# Altium project LAUNCHXL-F28377S.PrjPcb
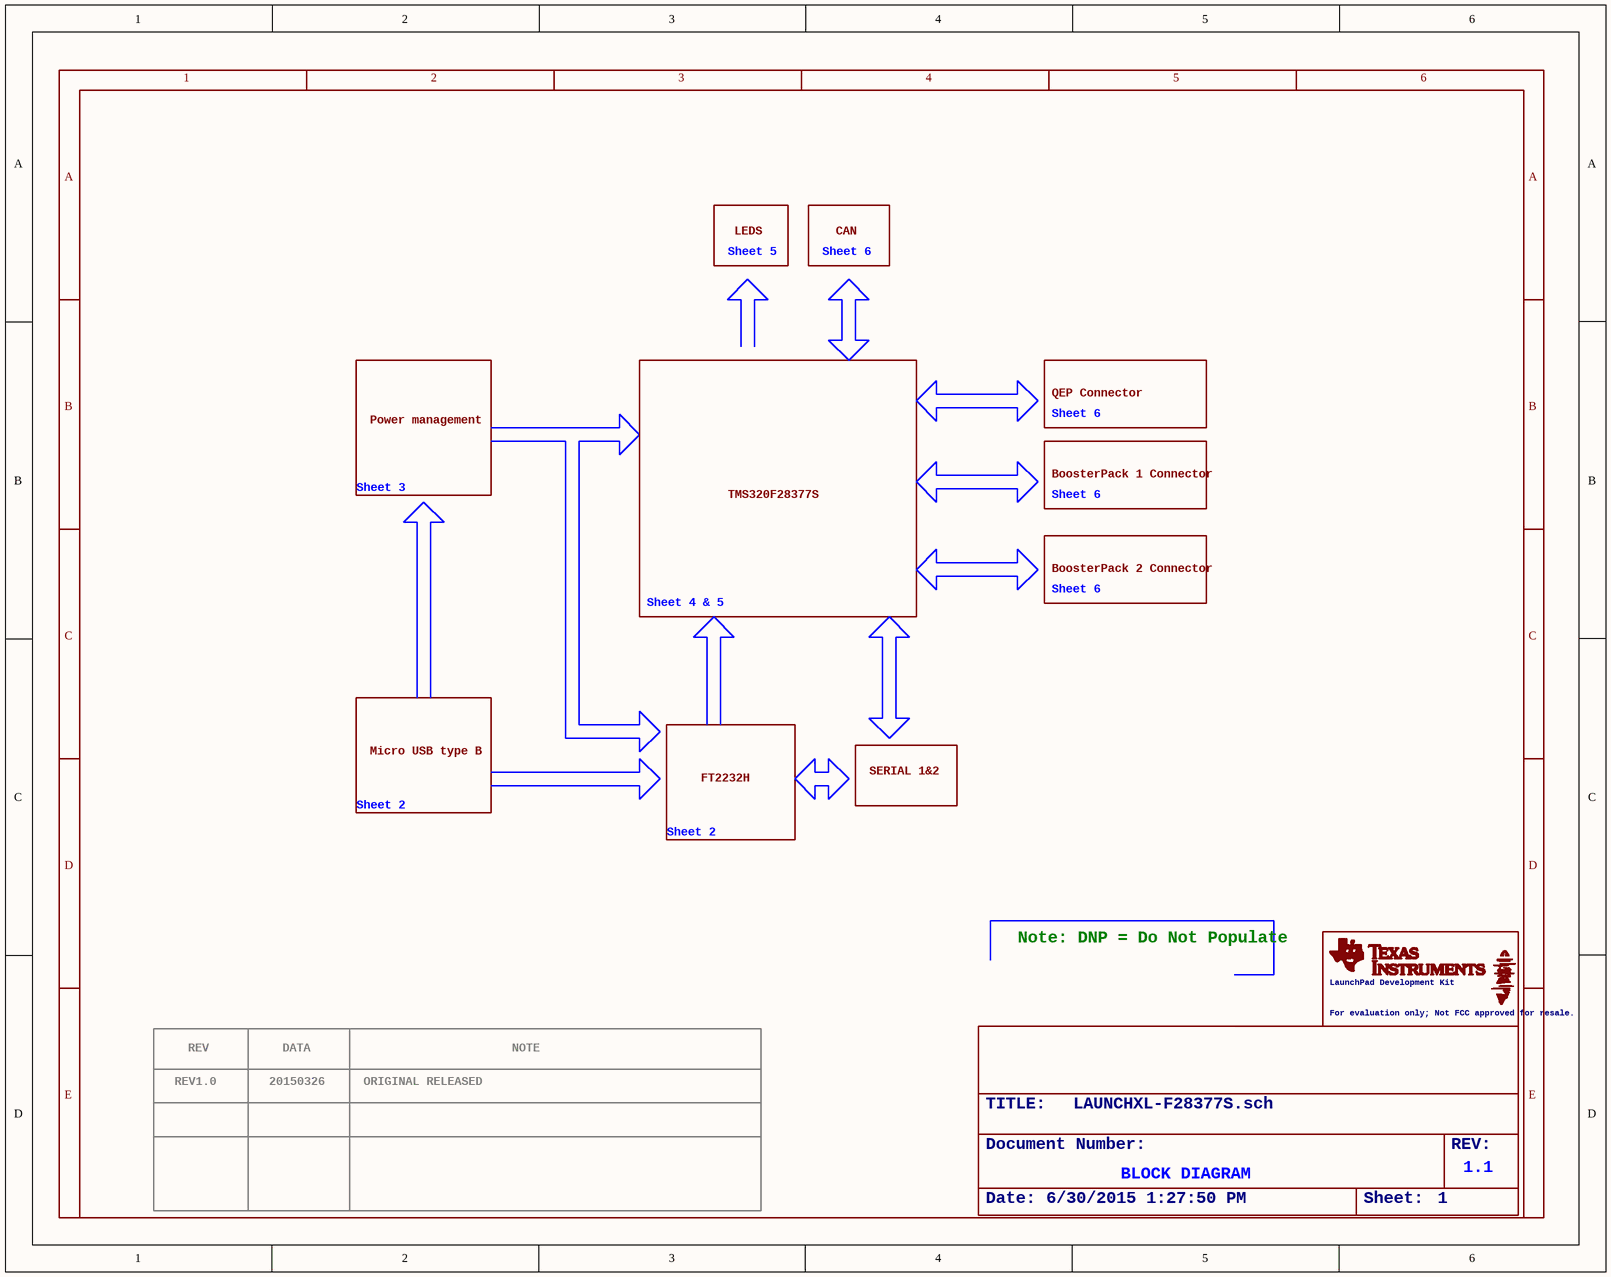
[diagram p0: LAUNCHXL-F28377S_0.SchDoc]
6 sheets, 203 parts. Net scope: global (net labels, ports and power ports of the same name join across sheets).
Sheets:
  LAUNCHXL-F28377S_0.SchDoc
  LAUNCHXL-F28377S_1.SchDoc
  LAUNCHXL-F28377S_2.SchDoc
  LAUNCHXL-F28377S_3.SchDoc
  LAUNCHXL-F28377S_4.SchDoc
  LAUNCHXL-F28377S_5.SchDoc

## Sheet LAUNCHXL-F28377S_0.SchDoc: LAUNCHXL-F28377S.sch
size 301 x 238 mm; Date: 6/30/2015 1:27:50 PM; DocumentNumber: Document Number:; Revision: REV:; SheetNumber: 1

### Parts
COMPLIANCE1  COMPLIANCE_NOT_FCC_TESTEDBOARDS_LARGER_THAN_4IN  [COMPLIANCE_NOT_FCC]  (value not drawn)

### Notes on the sheet
- Sheet 5
- LEDS
- Sheet 6
- CAN
- QEP Connector
- Sheet 3
- Power management
- BoosterPack 1 Connector
- TMS320F28377S
- Sheet 4 & 5
- BoosterPack 2 Connector
- Micro USB type B
- Sheet 2
- FT2232H
- SERIAL 1&2
- Note: DNP = Do Not Populate
- REV1.0
- REV
- 20150326
- DATA
- ORIGINAL RELEASED
- NOTE
- BLOCK DIAGRAM
- 1.1
- 1
- 2
- 3
- 4
- 5
- 6
- A
- B
- C
- D
- E

### Library data of the parts
COMPLIANCE1 = COMPLIANCE_NOT_FCC_TESTEDBOARDS_LARGER_THAN_4IN: For evaluation only;

## Sheet LAUNCHXL-F28377S_1.SchDoc: LAUNCHXL-F28377S.sch
size 301 x 237 mm; Date: 6/30/2015 1:27:53 PM; DocumentNumber: Document Number:; Revision: REV:; SheetNumber: 2
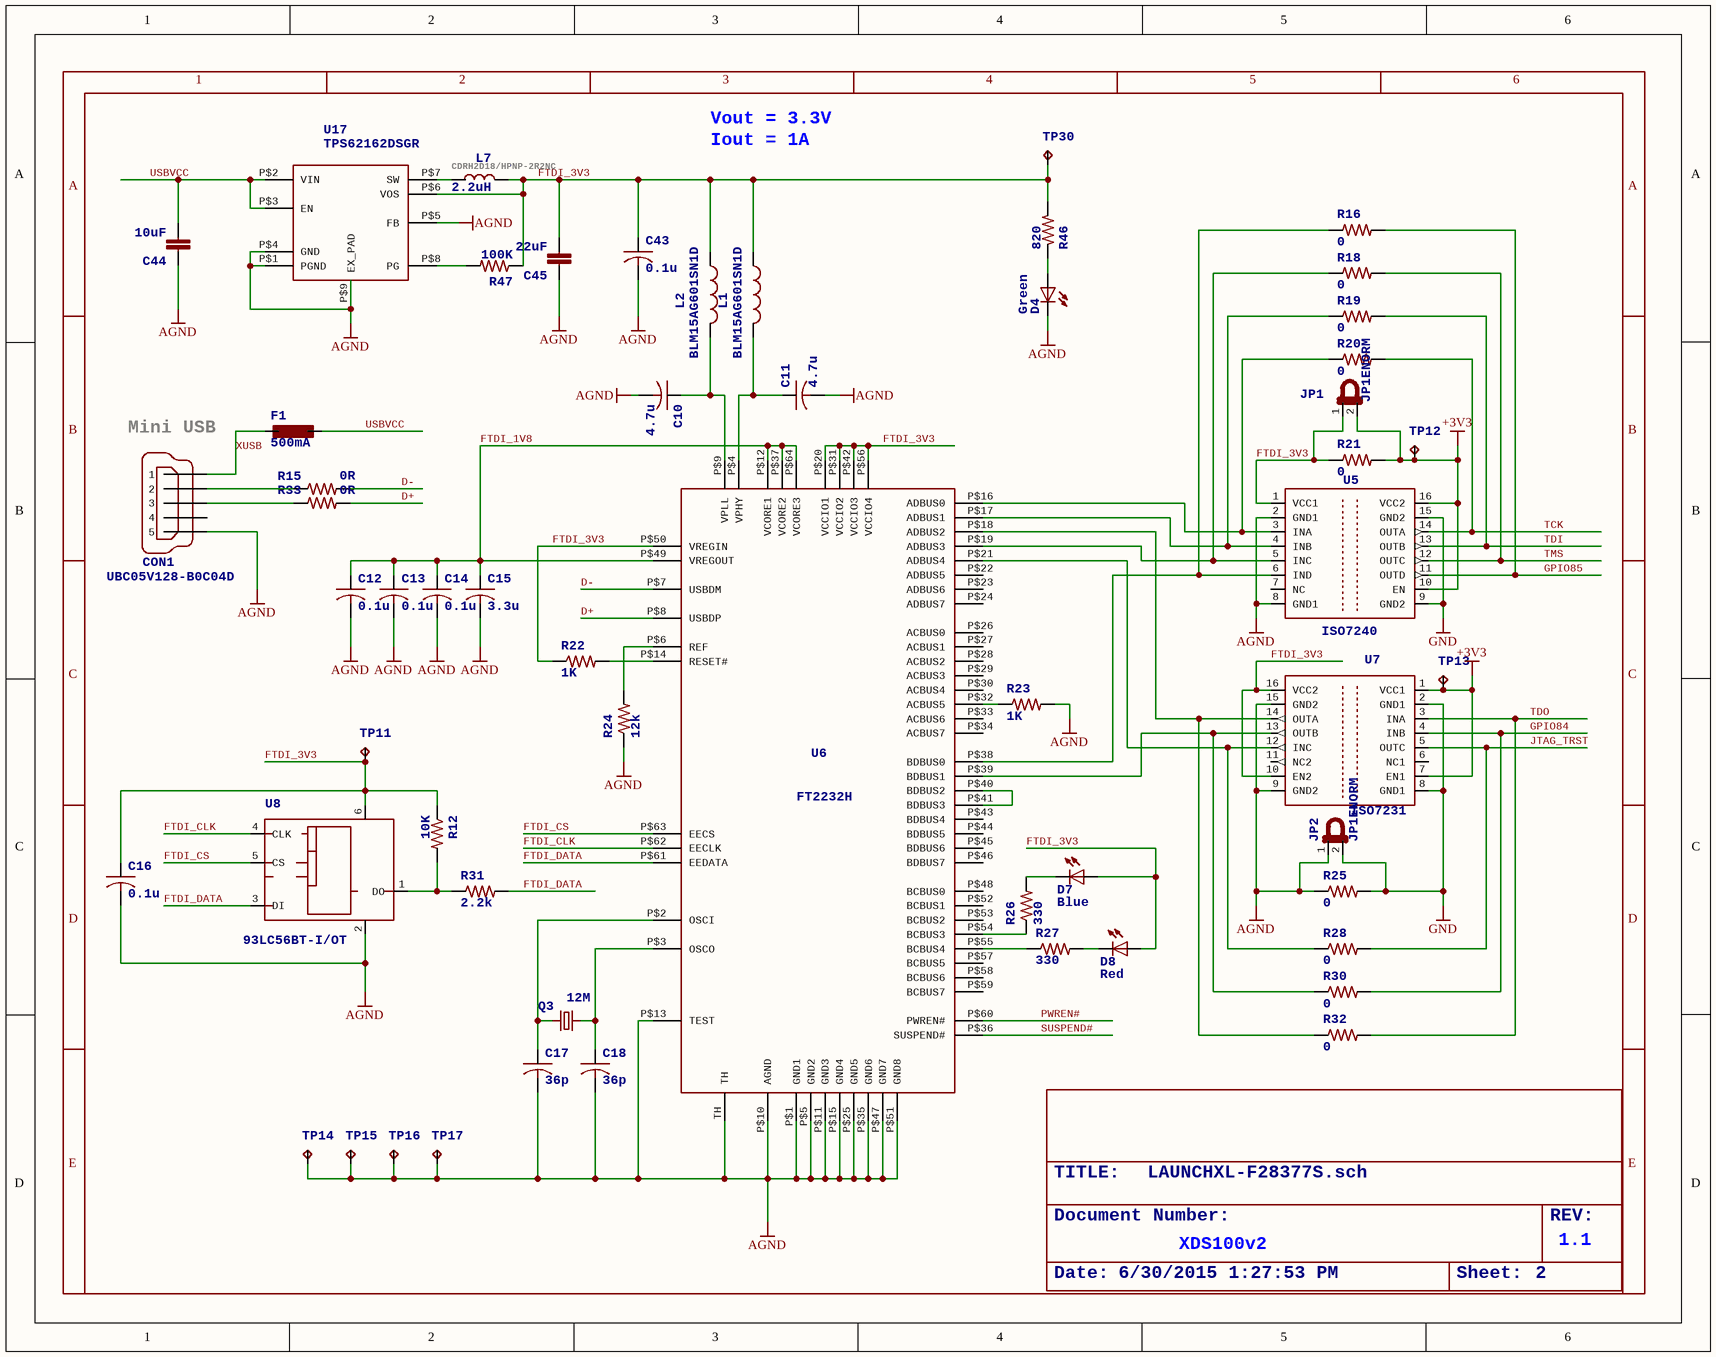
[diagram p1: LAUNCHXL-F28377S_1.SchDoc]

### Parts
C10  4.7u  [C0402]
C11  4.7u  [C0402]
C12  0.1u  [C0402]
C13  0.1u  [C0402]
C14  0.1u  [C0402]
C15  3.3u  [C0402]
C16  0.1u  [C0402]
C17  36p  [C0402]
C18  36p  [C0402]
C43  0.1u  [C0402]
C44  10uF  [SPARKFUN_1210]
C45  22uF  [SPARKFUN_1210]
CON1  UBC05V128-B0C04D  [32005-201]
D4  Green  [CHIP-LED0603]
D7  Blue  [CHIP-LED0603]
D8  Red  [CHIP-LED0603]
F1  500mA  [L1812]
JP1  JP1ENORM  [JP1]
JP2  JP1ENORM  [JP1]
L1  BLM15AG601SN1D  [R0402]
L2  BLM15AG601SN1D  [R0402]
L7  2.2uH  [INDUCT-3.2*3.2]
Q3  12M  [HC49UP]
R12  10K  [R0402]
R15  0R  [R0402]
R16  0  [R1206]
R18  0  [R1206]
R19  0  [R1206]
R20  0  [R1206]
R21  0  [R1206]
R22  1K  [R0402]
R23  1K  [R0402]
R24  12k  [R0402]
R25  0  [R1206]
R26  330  [R0402]
R27  330  [R0402]
R28  0  [R1206]
R30  0  [R1206]
R31  2.2k  [R0402]
R32  0  [R1206]
R33  0R  [R0402]
R46  820  [R0402]
R47  100K  [R0402]
TP11  TESTPAD_TPB1,27  [TESTPAD_B1,27]  (value not drawn)
TP12  TESTPAD_TPB1,27  [TESTPAD_B1,27]  (value not drawn)
TP13  TESTPAD_TPB1,27  [TESTPAD_B1,27]  (value not drawn)
TP14  TESTPAD_TPB1,27  [TESTPAD_B1,27]  (value not drawn)
TP15  TESTPAD_TPB1,27  [TESTPAD_B1,27]  (value not drawn)
TP16  TESTPAD_TPB1,27  [TESTPAD_B1,27]  (value not drawn)
TP17  TESTPAD_TPB1,27  [TESTPAD_B1,27]  (value not drawn)
TP30  TESTPAD_TPB1,27  [TESTPAD_B1,27]  (value not drawn)
U5  ISO7240  [SO-16DW]
U6  FT2232H  [QFN64]
U7  ISO7231  [SO-16DW]
U8  93LC56BT-I/OT  [SOT23-6]
U17  TPS62162DSGR  [TI_DSG8]
U$10  ROY_JUMPER  [ROY_JUMPER]  (value not drawn)
U$11  ROY_JUMPER  [ROY_JUMPER]  (value not drawn)

### Nets
+3V3: JP1.2 R21.2 TP12.TP TP13.TP U5.10(EN) U5.16(VCC2) U7.1(VCC1) U7.7(EN1)
AGND: C10.2 C11.2 C12.2 C13.2 C14.2 C15.2 C16.2 C17.2 C18.2 C43.2 C44.1 C45.1 CON1.5 D4.C JP2.1 R23.2 R24.1 R25.1 TP14.TP TP15.TP TP16.TP TP17.TP U5.2(GND1) U5.8(GND1) U6.P$1(GND1) U6.P$5(GND2) U6.P$10(AGND) U6.P$11(GND3) U6.P$13(TEST) U6.P$15(GND4) U6.P$25(GND5) U6.P$35(GND6) U6.P$47(GND7) U6.P$51(GND8) U6.TH U7.9(GND2) U7.15(GND2) U8.2(GND) U17.P$1(PGND) U17.P$4(GND) U17.P$5(FB) U17.P$9(EX_PAD)
GND: JP2.2 R25.2 U5.9(GND2) U5.15(GND2) U7.2(GND1) U7.8(GND1)
D+: R33.2 U6.P$8(USBDP)
D-: R15.2 U6.P$7(USBDM)
FTDI_1V8: C12.1 C13.1 C14.1 C15.1 U6.P$12(VCORE1) U6.P$37(VCORE2) U6.P$49(VREGOUT) U6.P$64(VCORE3)
FTDI_3V3: C16.1 C43.1 C45.2 D7.A D8.A JP1.1 L1.1 L2.1 L7.P$1 R12.1 R21.1 R22.1 R46.2 R47.1 TP11.TP TP30.TP U5.1(VCC1) U6.P$20(VCCIO1) U6.P$31(VCCIO2) U6.P$42(VCCIO3) U6.P$50(VREGIN) U6.P$56(VCCIO4) U7.10(EN2) U7.16(VCC2) U8.6(VCC) U17.P$6(VOS)
FTDI_CLK: U6.P$62(EECLK) U8.4(CLK)
FTDI_CS: U6.P$63(EECS) U8.5(CS)
FTDI_DATA: R31.2 U6.P$61(EEDATA) U8.3(DI)
GPIO84: R30.2 U7.4(INB)
GPIO85: R16.2 U5.11(OUTD)
JTAG_TRST: R28.2 U7.5(OUTC)
PWREN#: U6.P$60(PWREN#)
SUSPEND#: U6.P$36(SUSPEND#)
TCK: R20.2 U5.14(OUTA)
TDI: R19.2 U5.13(OUTB)
TDO: R32.2 U7.3(INA)
TMS: R18.2 U5.12(OUTC)
USBVCC: C44.2 F1.1 U17.P$2(VIN) U17.P$3(EN)
XUSB: CON1.1 F1.2
NetC10_1: C10.1 L2.2 U6.P$9(VPLL)
NetC11_1: C11.1 L1.2 U6.P$4(VPHY)
NetC17_1: C17.1 Q3.1 U6.P$2(OSCI)
NetC18_1: C18.1 Q3.2 U6.P$3(OSCO)
NetCON1_2: CON1.2 R15.1
NetCON1_3: CON1.3 R33.1
NetD4_A: D4.A R46.1
NetD7_C: D7.C R26.2
NetD8_C: D8.C R27.2
NetL7_P$2: L7.P$2 U17.P$7(SW)
NetR12_2: R12.2 R31.1 U8.1(DO)
NetR16_1: R16.1 U5.6(IND) U6.P$38(BDBUS0)
NetR18_1: R18.1 U5.5(INC) U6.P$19(ADBUS3)
NetR19_1: R19.1 U5.4(INB) U6.P$17(ADBUS1)
NetR20_1: R20.1 U5.3(INA) U6.P$16(ADBUS0)
NetR22_2: R22.2 U6.P$14(RESET#)
NetR23_1: R23.1 U6.P$32(ACBUS5)
NetR24_2: R24.2 U6.P$6(REF)
NetR26_1: R26.1 U6.P$54(BCBUS3)
NetR27_1: R27.1 U6.P$55(BCBUS4)
NetR28_1: R28.1 U6.P$21(ADBUS4) U7.12(INC)
NetR30_1: R30.1 U6.P$39(BDBUS1) U7.13(OUTB)
NetR32_1: R32.1 U6.P$18(ADBUS2) U7.14(OUTA)
NetR47_2: R47.2 U17.P$8(PG)
NetU6_P$40: U6.P$40(BDBUS2) U6.P$41(BDBUS3)

Not connected (* = marked no-connect by the designer): CON1 4; U5 7(NC); U6 P$22(ADBUS5) P$23(ADBUS6) P$24(ADBUS7) P$26(ACBUS0) P$27(ACBUS1) P$28(ACBUS2) P$29(ACBUS3) P$30(ACBUS4) P$33(ACBUS6) P$34(ACBUS7) P$43(BDBUS4) P$44(BDBUS5) P$45(BDBUS6) P$46(BDBUS7) P$48(BCBUS0) P$52(BCBUS1) P$53(BCBUS2) P$57(BCBUS5) P$58(BCBUS6) P$59(BCBUS7); U7 6(NC1) 11(NC2)

### Notes on the sheet
- Vout = 3.3V
- Iout = 1A
- (near L7) CDRH2D18/HPNP-2R2NC
- (near CON1) Mini USB
- XDS100v2
- 1.1
- 1
- 2
- 3
- 4
- 5
- 6
- A
- B
- C
- D
- E

### Library data of the parts
C10-C18 C43 = C-USC0402: <B>CAPACITOR</B>, American symbol
C44 C45 = SPARKFUN_CAP1210: <b>Capacitor</b> / Standard 0603 ceramic capacitor, and 0.1" leaded capacitor.
CON1 = MINI-USB-32005-201: <b>MINI USB-B Conector</b><p> / Source: www.cypressindustries.com
D4 D7 D8 = LEDCHIP-LED0603: <b>LED</b><p> / <u>OSRAM</u>:<br> / - <u>CHIPLED</u><br> / LG R971, LG N971, LY N971, LG Q971, LY Q971, LO R971, LY R971 / LH N974, LH R974<br> / LS Q976, LO Q976, LY Q976<br> / LO Q996<br> / - <u>Hyper CHIPLED</u><br> / LW Q18S<br> / LB Q993, LB Q99A, LB R99A<br> / - <u>SideLED</u><br> / LS A670, LO A670, LY A670, LG A670, LP A670<br> / LB A673, LV A673, LT A673, LW A673<br> / LH A674<br> / LY A675<br> / LS A676, LA A676, LO A676, LY A676, LW A676<br> / LS A679, LY A679, LG A679<br> / -  <u>Hyper Micro SIDELED®</u><br> / LS Y876, LA Y876, LO Y876, LY Y876<br> / LT Y87S<br> / - <u>SmartLED</u><br> / LW L88C, LW L88S<br> / LB L89C, LB L89S, LG L890<br> / LS L89K, LO L89K, LY L89K<br> / LS L896, LA L896, LO L896, LY L896<br> / - <u>TOPLED</u><br> / LS T670, LO T670, LY T670, LG T670, LP T670<br> / LSG T670, LSP T670, LSY T670, LOP T670, LYG T670<br> / LG T671, LOG T671, LSG T671<br> / LB T673, LV T673, LT T673, LW T673<br> / LH T674<br> / LS T676, LA T676, LO T676, LY T676, LB T676, LH T676, LSB T676, LW T676<br> / LB T67C, LV T67C, LT T67C, LS T67K, LO T67K, LY T67K, LW E67C<br> / LS E67B, LA E67B, LO E67B, LY E67B, LB E67C, LV E67C, LT E67C<br> / LW T67C<br> / LS T679, LY T679, LG T679<br> / LS T770, LO T770, LY T770, LG T770, LP T770<br> / LB T773, LV T773, LT T773, LW T773<br> / LH T774<br> / LS E675, LA E675, LY E675, LS T675<br> / LS T776, LA T776, LO T776, LY T776, LB T776<br> / LHGB T686<br> / LT T68C, LB T68C<br> / - <u>Hyper Mini TOPLED®</u><br> / LB M676<br> / - <u>Mini TOPLED Santana®</u><br> / LG M470<br> / LS M47K, LO M47K, LY M47K / <p> / Source: http://www.osram.convergy.de<p> / <u>LUXEON:</u><br> / - <u>LUMILED®</u><br> / LXK2-PW12-R00, LXK2-PW12-S00, LXK2-PW14-U00, LXK2-PW14-V00<br> / LXK2-PM12-R00, LXK2-PM12-S00, LXK2-PM14-U00<br> / LXK2-PE12-Q00, LXK2-PE12-R00, LXK2-PE12-S00, LXK2-PE14-T00, LXK2-PE14-U00<br> / LXK2-PB12-K00, LXK2-PB12-L00, LXK2-PB12-M00, LXK2-PB14-N00, LXK2-PB14-P00, LXK2-PB14-Q00<br> / LXK2-PR12-L00, LXK2-PR12-M00, LXK2-PR14-Q00, LXK2-PR14-R00<br> / LXK2-PD12-Q00, LXK2-PD12-R00, LXK2-PD12-S00<br> / LXK2-PH12-R00, LXK2-PH12-S00<br> / LXK2-PL12-P00, LXK2-PL12-Q00, LXK2-PL12-R00 / <p> / Source: www.luxeon.com<p> / <u>KINGBRIGHT:</U><p> / KA-3528ASYC<br> / Source: www.kingbright.com
F1 = L-EUL1812: <B>INDUCTOR</B>, European symbol
JP1 JP2 = JP1ENORM: <b>JUMPER</b>
L1 L2 = L-US0402: <B>INDUCTOR</B>, American symbol
L7 = VLF4012A`
Q3 = CRYSTALHC49UP: <b>CRYSTAL</b>
R12 R15 R22-R24 R26 R27 R31 R33 R46 R47 = R-US_R0402: <B>RESISTOR</B>, American symbol
R16 R18-R21 R25 R28 R30 R32 = R-US_R1206: <B>RESISTOR</B>, American symbol
TP11-TP17 TP30 = TESTPAD_TPB1,27: <b>Test pad</b>
U5 = ISO7240: <b>HIGH SPEED QUAD DIGITAL ISOLATORS</b><p> / Source: http://focus.ti.com/lit/ds/symlink/iso7240m.pdf
U8 = 93*: Serial <B>EPROM</B><p> / 1 K/2 K/4 K, low voltage, Microwire

## Sheet LAUNCHXL-F28377S_2.SchDoc
size 301 x 237 mm
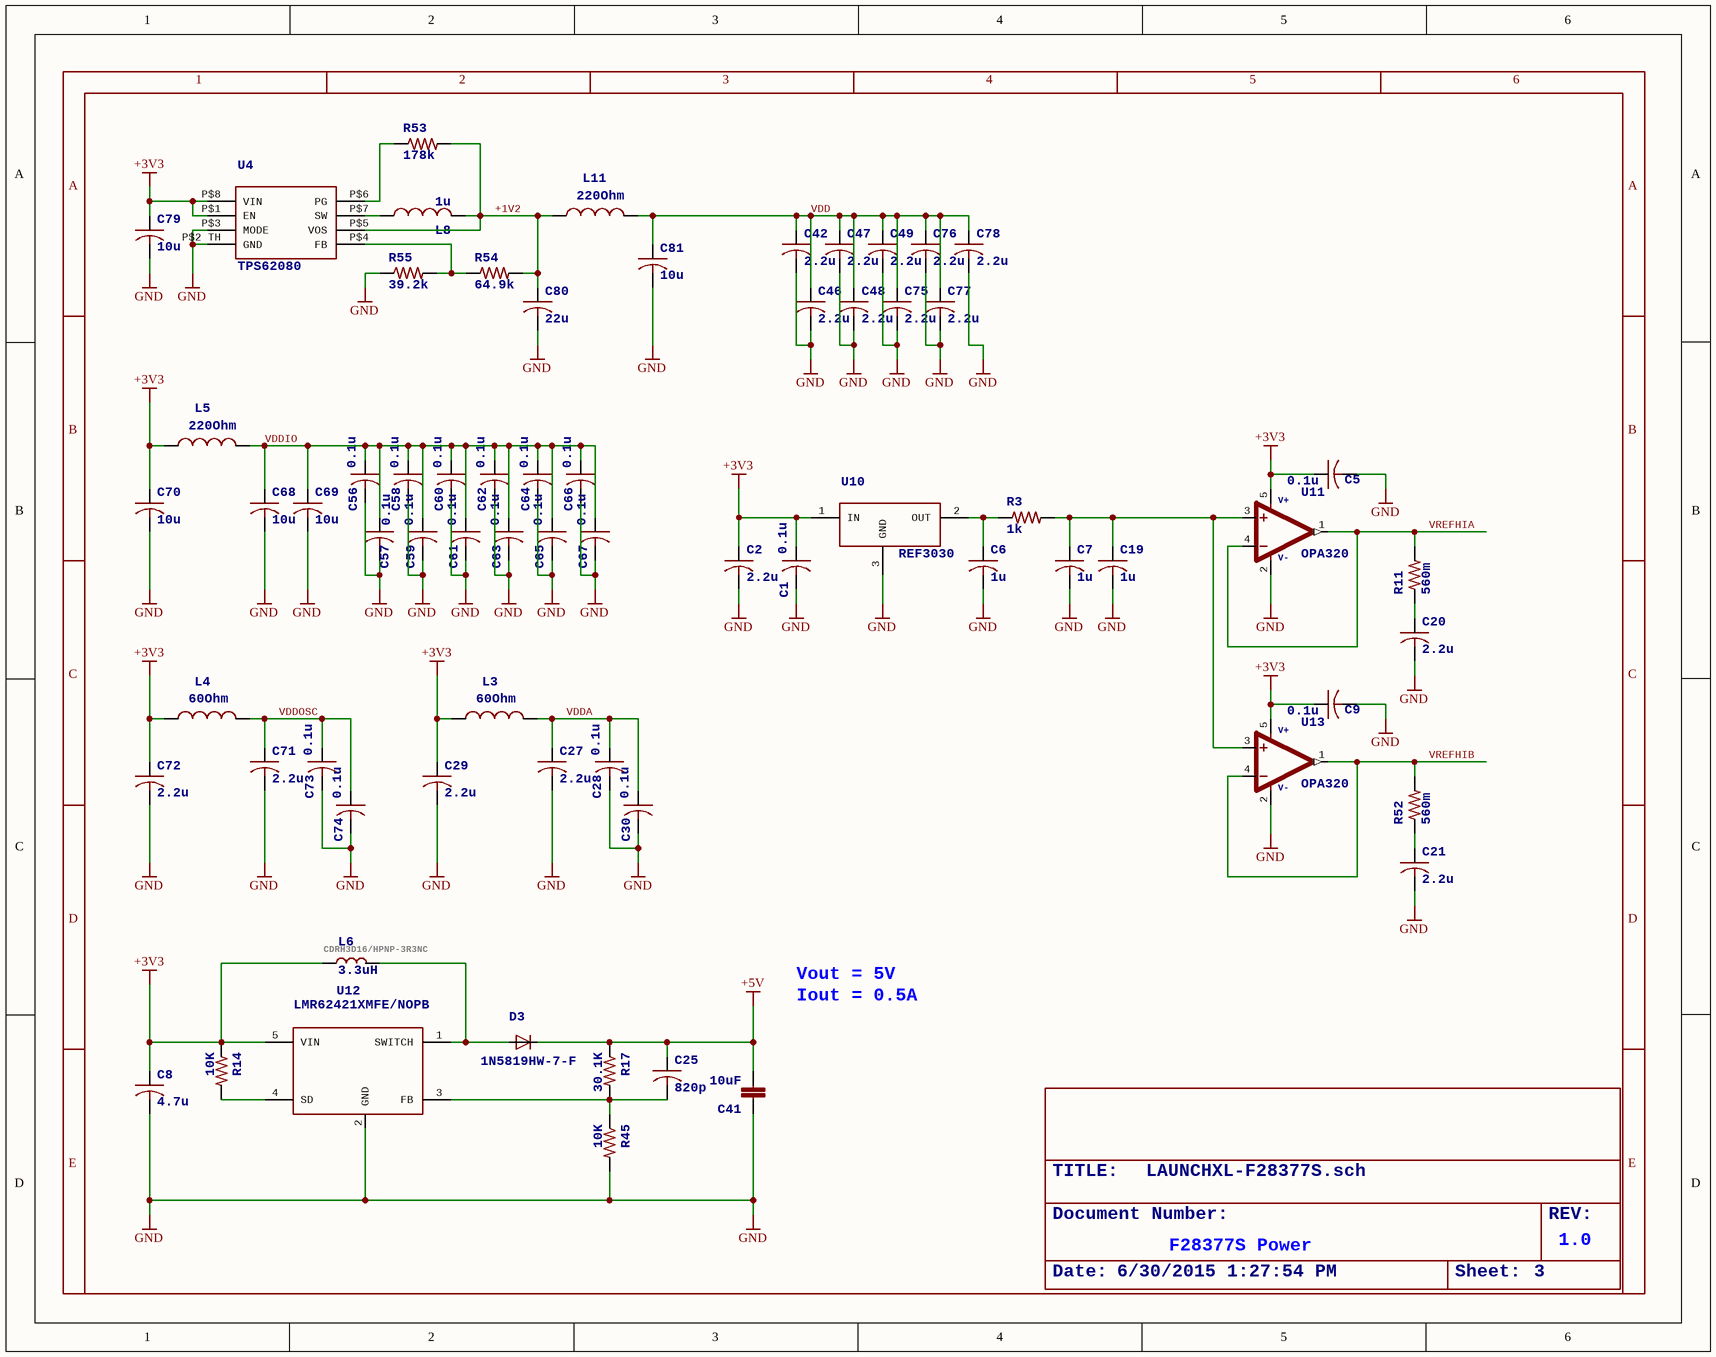
[diagram p2: LAUNCHXL-F28377S_2.SchDoc]

### Parts
C1  0.1u  [C0402]
C2  2.2u  [C0402]
C5  0.1u  [C0402]
C6  1u  [C0402]
C7  1u  [C0402]
C8  4.7u  [C0402]
C9  0.1u  [C0402]
C19  1u  [C0402]
C20  2.2u  [C0402]
C21  2.2u  [C0402]
C25  820p  [C0402]
C27  2.2u  [C0402]
C28  0.1u  [C0402]
C29  2.2u  [C0402]
C30  0.1u  [C0402]
C41  10uF  [SPARKFUN_1210]
C42  2.2u  [C0402]
C46  2.2u  [C0402]
C47  2.2u  [C0402]
C48  2.2u  [C0402]
C49  2.2u  [C0402]
C56  0.1u  [C0402]
C57  0.1u  [C0402]
C58  0.1u  [C0402]
C59  0.1u  [C0402]
C60  0.1u  [C0402]
C61  0.1u  [C0402]
C62  0.1u  [C0402]
C63  0.1u  [C0402]
C64  0.1u  [C0402]
C65  0.1u  [C0402]
C66  0.1u  [C0402]
C67  0.1u  [C0402]
C68  10u  [C0603]
C69  10u  [C0603]
C70  10u  [C0603]
C71  2.2u  [C0402]
C72  2.2u  [C0402]
C73  0.1u  [C0402]
C74  0.1u  [C0402]
C75  2.2u  [C0402]
C76  2.2u  [C0402]
C77  2.2u  [C0402]
C78  2.2u  [C0402]
C79  10u  [C0603]
C80  22u  [C0603]
C81  10u  [C0603]
D3  1N5819HW-7-F  [SOD123]
FRAME8  >LAST_DATE_TIME: 6/30/2015 1:27:54 PM  >SHEET: 3  >DRAWING_NAME: LAUNCHXL-F28377S.sch  (hidden comment: FRAME_A_L)
L3  60Ohm  [R0402]
L4  60Ohm  [R0402]
L5  220Ohm  [R0402]
L6  3.3uH  [INDUCT-3_7*3_5]
L8  1u  [L1212]
L11  220Ohm  [R0402]
R3  1k  [R0402]
R11  560m  [R0402]
R14  10K  [R0402]
R17  30.1K  [R0402]
R45  10K  [R0402]
R52  560m  [R0402]
R53  178k  [R0402]
R54  64.9k  [R0402]
R55  39.2k  [R0402]
U4  TPS62080  [SON8]
U10  REF3030  [DBZ_R-PDSO-G3]
U11  OPA320  [SOT23-5-DBV]
U12  LMR62421XMFE/NOPB  [SOT23-5-DBV]
U13  OPA320  [SOT23-5-DBV]

### Nets
+3V3: C1.1 C2.1 C5.1 C8.1 C9.1 C29.1 C70.1 C72.1 C79.1 L3.1 L4.1 L5.1 L6.P$1 R14.1 U4.P$1(EN) U4.P$8(VIN) U10.1(IN) U11.5(V+) U12.5(VIN) U13.5(V+)
+5V: C25.1 C41.2 D3.C R17.1  [project net EQEP1A]
GND: C1.2 C2.2 C5.2 C6.2 C7.2 C8.2 C9.2 C19.2 C20.2 C21.2 C27.2 C28.2 C29.2 C30.2 C41.1 C42.2 C46.2 C47.2 C48.2 C49.2 C56.2 C57.2 C58.2 C59.2 C60.2 C61.2 C62.2 C63.2 C64.2 C65.2 C66.2 C67.2 C68.2 C69.2 C70.2 C71.2 C72.2 C73.2 C74.2 C75.2 C76.2 C77.2 C78.2 C79.2 C80.2 C81.2 R45.2 R55.1 U4.P$2_TH(GND) U4.P$3(MODE) U10.3(GND) U11.2(V-) U12.2(GND) U13.2(V-)
+1V2: C80.1 L8.P$2 L11.1 R53.2 R54.2 U4.P$5(VOS)
VDD: C42.1 C46.1 C47.1 C48.1 C49.1 C75.1 C76.1 C77.1 C78.1 C81.1 L11.2
VDDA: C27.1 C28.1 C30.1 L3.2
VDDIO: C56.1 C57.1 C58.1 C59.1 C60.1 C61.1 C62.1 C63.1 C64.1 C65.1 C66.1 C67.1 C68.1 C69.1 L5.2
VDDOSC: C71.1 C73.1 C74.1 L4.2
VREFHIA: R11.2 U11.1(OUT) U11.4(-IN)
VREFHIB: R52.2 U13.1(OUT) U13.4(-IN)
NetC6_1: C6.1 R3.1 U10.2(OUT)
NetC7_1: C7.1 C19.1 R3.2 U11.3(+IN) U13.3(+IN)
NetC20_1: C20.1 R11.1
NetC21_1: C21.1 R52.1
NetC25_2: C25.2 R17.2 R45.1 U12.3(FB)
NetD3_A: D3.A L6.P$2 U12.1(SWITCH)
NetL8_P$1: L8.P$1 U4.P$7(SW)
NetR14_2: R14.2 U12.4(SD)
NetR53_1: R53.1 U4.P$6(PG)
NetR54_1: R54.1 R55.2 U4.P$4(FB)

### Notes on the sheet
- (near L6) CDRH3D16/HPNP-3R3NC
- Vout = 5V
- Iout = 0.5A
- F28377S Power
- 1.0
- 1
- 2
- 3
- 4
- 5
- 6
- A
- B
- C
- D
- E

### Library data of the parts
C1 C2 C5-C9 C19-C21 C25 C27-C30 C42 C46-C49 C56-C67 C71-C78 = C-USC0402: <B>CAPACITOR</B>, American symbol
C41 = SPARKFUN_CAP1210: as C44 on sheet LAUNCHXL-F28377S_1
C68-C70 C79-C81 = C-USC0603: <B>CAPACITOR</B>, American symbol
D3 = 1N4148: <B>DIODE</B><p> / high speed (Philips)
FRAME8 = FRAME_A_L: <b>FRAME</b> A Size , 8 1/2 x 11 INCH, Landscape<p>; Date:: Date:; Sheet:: Sheet:; REV:: REV:; TITLE:: TITLE:; Document Number:: Document Number:
L3-L5 L11 = L-US0402: <B>INDUCTOR</B>, American symbol
L6 = VLF4012A
L8 = L-USL1212: <B>INDUCTOR</B>, American symbol
R3 R11 R14 R17 R45 R52-R55 = R-US_R0402: <B>RESISTOR</B>, American symbol
U10 = REF30XX
U11 U13 = OPA320: V+: V+; V-: V-

## Sheet LAUNCHXL-F28377S_3.SchDoc: LAUNCHXL-F28377S.sch
size 301 x 237 mm; Date: 6/30/2015 1:27:57 PM; DocumentNumber: Document Number:; Revision: REV:; SheetNumber: 4
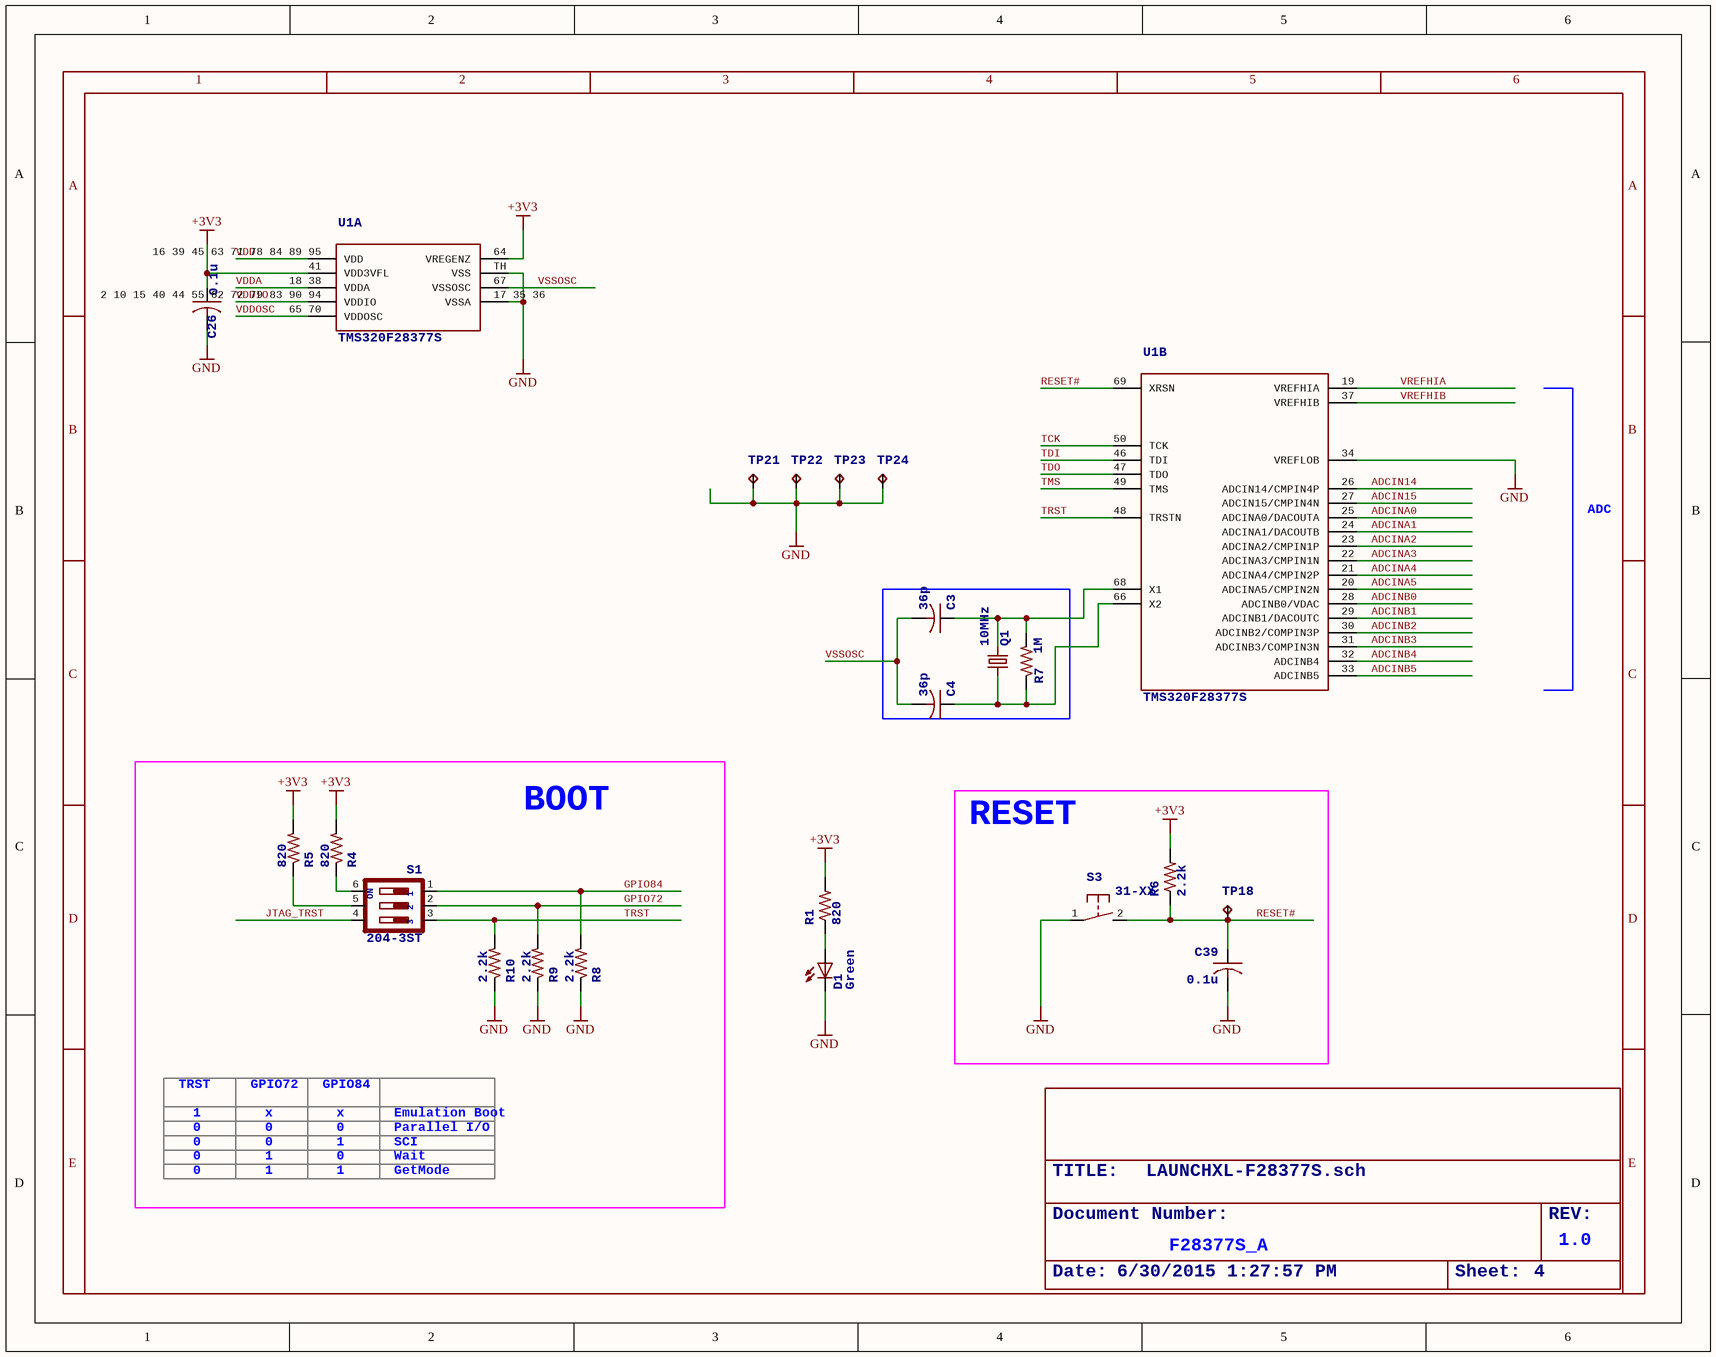
[diagram p3: LAUNCHXL-F28377S_3.SchDoc]

### Parts
C3  36p  [C0402]
C4  36p  [C0402]
C26  0.1u  [C0402]
C39  0.1u  [C0402]
D1  Green  [CHIP-LED0603]
Q1  10MHz  [HC49/S]
R1  820  [R0402]
R4  820  [R0402]
R5  820  [R0402]
R6  2.2k  [R0402]
R7  1M  [R0402]
R8  2.2k  [R0402]
R9  2.2k  [R0402]
R10  2.2k  [R0402]
S1  204-3ST  [CTS-219-03]
S3  31-XX  [B3F-31XX]
TP18  TESTPAD_TPB1,27  [TESTPAD_B1,27]  (value not drawn)
TP21  TESTPAD_TPB1,27  [TESTPAD_B1,27]  (value not drawn)
TP22  TESTPAD_TPB1,27  [TESTPAD_B1,27]  (value not drawn)
TP23  TESTPAD_TPB1,27  [TESTPAD_B1,27]  (value not drawn)
TP24  TESTPAD_TPB1,27  [TESTPAD_B1,27]  (value not drawn)
U1  TMS320F28377S  [PQFP100_THERMAL]  (parts A,B of 3)

### Blocks framed on the sheet
BOOT: R4 R5 R8-R10 S1
RESET: C39 R6 S3 TP18

### Nets
+3V3: C26.1 R1.2 R4.2 R5.2 R6.2 U1.41(VDD3VFL) U1.64(VREGENZ)
GND: C26.2 C39.2 D1.C R8.1 R9.1 R10.1 S3.1(P) TP21.TP TP22.TP TP23.TP TP24.TP U1.17_35_36(VSSA) U1.34(VREFLOB) U1.TH(VSS)
ADCIN14: U1.26(ADCIN14/CMPIN4P)
ADCIN15: U1.27(ADCIN15/CMPIN4N)
ADCINA0: U1.25(ADCINA0/DACOUTA)
ADCINA1: U1.24(ADCINA1/DACOUTB)
ADCINA2: U1.23(ADCINA2/CMPIN1P)
ADCINA3: U1.22(ADCINA3/CMPIN1N)
ADCINA4: U1.21(ADCINA4/CMPIN2P)
ADCINA5: U1.20(ADCINA5/CMPIN2N)
ADCINB0: U1.28(ADCINB0/VDAC)
ADCINB1: U1.29(ADCINB1/DACOUTC)
ADCINB2: U1.30(ADCINB2/COMPIN3P)
ADCINB3: U1.31(ADCINB3/COMPIN3N)
ADCINB4: U1.32(ADCINB4)
ADCINB5: U1.33(ADCINB5)
GPIO72: R9.2 S1.2
GPIO84: R8.2 S1.1
JTAG_TRST: S1.4
RESET#: C39.1 R6.1 S3.2(S) TP18.TP U1.69(XRSN)
TCK: U1.50(TCK)
TDI: U1.46(TDI)
TDO: U1.47(TDO)
TMS: U1.49(TMS)
TRST: R10.2 S1.3 U1.48(TRSTN)
VDD: U1.16_39_45_63_71_78_84_89_95(VDD)
VDDA: U1.18_38(VDDA)
VDDIO: U1.2_10_15_40_44_55_62_72_79_83_90_94(VDDIO)
VDDOSC: U1.65_70(VDDOSC)
VREFHIA: U1.19(VREFHIA)
VREFHIB: U1.37(VREFHIB)
VSSOSC: C3.2 C4.2 U1.67(VSSOSC)
NetC3_1: C3.1 Q1.2 R7.2 U1.68(X1)
NetC4_1: C4.1 Q1.1 R7.1 U1.66(X2)
NetD1_A: D1.A R1.1
NetR4_1: R4.1 S1.6
NetR5_1: R5.1 S1.5

### Notes on the sheet
- ADC
- TRST
- GPIO72
- GPIO84
- 1
- 0
- x
- Emulation Boot
- Parallel I/O
- SCI
- Wait
- GetMode
- F28377S_A
- 1.0
- 2
- 3
- 4
- 5
- 6
- A
- B
- C
- D
- E

### Library data of the parts
C3 C4 C26 C39 = C-USC0402: <B>CAPACITOR</B>, American symbol
D1 = LEDCHIP-LED0603: as D4 on sheet LAUNCHXL-F28377S_1
Q1 = CRYSTALHC49S: <b>CRYSTAL</b>
R1 R4-R10 = R-US_R0402: <B>RESISTOR</B>, American symbol
S1 = 219-03*: <b>Surface Mount DIP Switch Series 219 SMT</b><p> / CTS Electronic Components<br> / Sourc: www.ctscorp.com; OC_FARNELL: unknown; OC_NEWARK: unknown; 1: 1; 2: 2; 3: 3; ON: ON
S3 = 31-XX: <b>OMRON SWITCH</b>; MPN: B3F-3100; OC_FARNELL: 959704; OC_NEWARK: 36M3582
TP18 TP21-TP24 = TESTPAD_TPB1,27: <b>Test pad</b>

## Sheet LAUNCHXL-F28377S_4.SchDoc: LAUNCHXL-F28377S.sch
size 301 x 237 mm; Date: 6/30/2015 1:27:58 PM; DocumentNumber: Document Number:; Revision: REV:; SheetNumber: 5
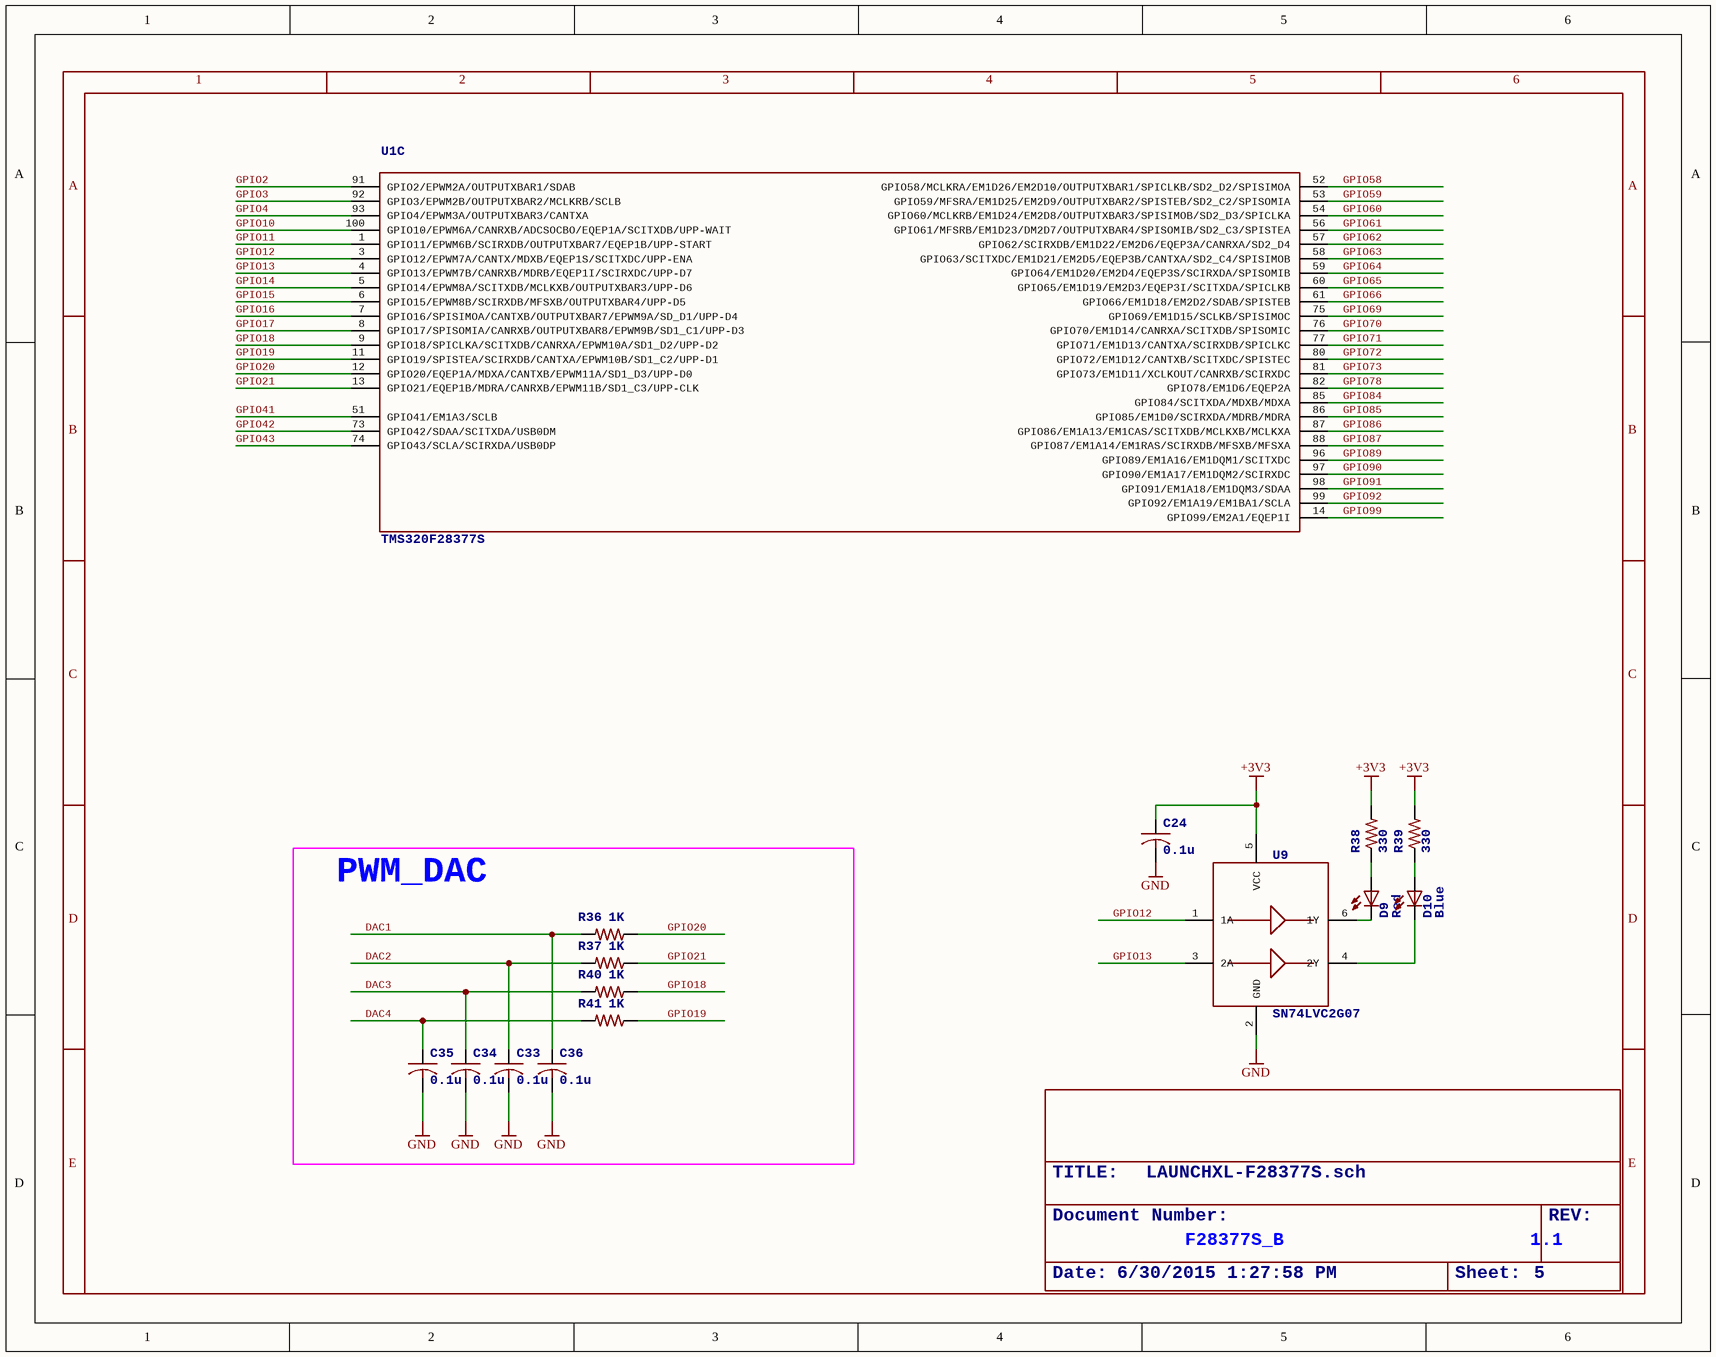
[diagram p4: LAUNCHXL-F28377S_4.SchDoc]

### Parts
C24  0.1u  [C0402]
C33  0.1u  [C0402]
C34  0.1u  [C0402]
C35  0.1u  [C0402]
C36  0.1u  [C0402]
D9  Red  [CHIP-LED0603]
D10  Blue  [CHIP-LED0603]
R36  1K  [R0402]
R37  1K  [R0402]
R38  330  [R0402]
R39  330  [R0402]
R40  1K  [R0402]
R41  1K  [R0402]
U1  TMS320F28377S  [PQFP100_THERMAL]  (part C of 3)
U9  SN74LVC2G07  [SOT23-6-DBV]

### Blocks framed on the sheet
PWM_DAC: C33-C36 R36 R37 R40 R41

### Nets
+3V3: C24.1 R38.2 R39.2 U9.5(VCC)
GND: C24.2 C33.2 C34.2 C35.2 C36.2 U9.2(GND)
DAC1: C36.1 R36.2
DAC2: C33.1 R37.2
DAC3: C34.1 R40.2
DAC4: C35.1 R41.2
GPIO2: U1.91(GPIO2/EPWM2A/OUTPUTXBAR1/SDAB)
GPIO3: U1.92(GPIO3/EPWM2B/OUTPUTXBAR2/MCLKRB/SCLB)
GPIO4: U1.93(GPIO4/EPWM3A/OUTPUTXBAR3/CANTXA)
GPIO10: U1.100(GPIO10/EPWM6A/CANRXB/ADCSOCBO/EQEP1A/SCITXDB/UPP-WAIT)
GPIO11: U1.1(GPIO11/EPWM6B/SCIRXDB/OUTPUTXBAR7/EQEP1B/UPP-START)
GPIO12: U1.3(GPIO12/EPWM7A/CANTX/MDXB/EQEP1S/SCITXDC/UPP-ENA) U9.1(1A)
GPIO13: U1.4(GPIO13/EPWM7B/CANRXB/MDRB/EQEP1I/SCIRXDC/UPP-D7) U9.3(2A)
GPIO14: U1.5(GPIO14/EPWM8A/SCITXDB/MCLKXB/OUTPUTXBAR3/UPP-D6)
GPIO15: U1.6(GPIO15/EPWM8B/SCIRXDB/MFSXB/OUTPUTXBAR4/UPP-D5)
GPIO16: U1.7(GPIO16/SPISIMOA/CANTXB/OUTPUTXBAR7/EPWM9A/SD_D1/UPP-D4)
GPIO17: U1.8(GPIO17/SPISOMIA/CANRXB/OUTPUTXBAR8/EPWM9B/SD1_C1/UPP-D3)
GPIO18: R40.1 U1.9(GPIO18/SPICLKA/SCITXDB/CANRXA/EPWM10A/SD1_D2/UPP-D2)
GPIO19: R41.1 U1.11(GPIO19/SPISTEA/SCIRXDB/CANTXA/EPWM10B/SD1_C2/UPP-D1)
GPIO20: R36.1 U1.12(GPIO20/EQEP1A/MDXA/CANTXB/EPWM11A/SD1_D3/UPP-D0)
GPIO21: R37.1 U1.13(GPIO21/EQEP1B/MDRA/CANRXB/EPWM11B/SD1_C3/UPP-CLK)
GPIO41: U1.51(GPIO41/EM1A3/SCLB)
GPIO42: U1.73(GPIO42/SDAA/SCITXDA/USB0DM)
GPIO43: U1.74(GPIO43/SCLA/SCIRXDA/USB0DP)
GPIO58: U1.52(GPIO58/MCLKRA/EM1D26/EM2D10/OUTPUTXBAR1/SPICLKB/SD2_D2/SPISIMOA)
GPIO59: U1.53(GPIO59/MFSRA/EM1D25/EM2D9/OUTPUTXBAR2/SPISTEB/SD2_C2/SPISOMIA)
GPIO60: U1.54(GPIO60/MCLKRB/EM1D24/EM2D8/OUTPUTXBAR3/SPISIMOB/SD2_D3/SPICLKA)
GPIO61: U1.56(GPIO61/MFSRB/EM1D23/DM2D7/OUTPUTXBAR4/SPISOMIB/SD2_C3/SPISTEA)
GPIO62: U1.57(GPIO62/SCIRXDB/EM1D22/EM2D6/EQEP3A/CANRXA/SD2_D4)
GPIO63: U1.58(GPIO63/SCITXDC/EM1D21/EM2D5/EQEP3B/CANTXA/SD2_C4/SPISIMOB)
GPIO64: U1.59(GPIO64/EM1D20/EM2D4/EQEP3S/SCIRXDA/SPISOMIB)
GPIO65: U1.60(GPIO65/EM1D19/EM2D3/EQEP3I/SCITXDA/SPICLKB)
GPIO66: U1.61(GPIO66/EM1D18/EM2D2/SDAB/SPISTEB)
GPIO69: U1.75(GPIO69/EM1D15/SCLKB/SPISIMOC)
GPIO70: U1.76(GPIO70/EM1D14/CANRXA/SCITXDB/SPISOMIC)
GPIO71: U1.77(GPIO71/EM1D13/CANTXA/SCIRXDB/SPICLKC)
GPIO72: U1.80(GPIO72/EM1D12/CANTXB/SCITXDC/SPISTEC)
GPIO73: U1.81(GPIO73/EM1D11/XCLKOUT/CANRXB/SCIRXDC)
GPIO78: U1.82(GPIO78/EM1D6/EQEP2A)
GPIO84: U1.85(GPIO84/SCITXDA/MDXB/MDXA)
GPIO85: U1.86(GPIO85/EM1D0/SCIRXDA/MDRB/MDRA)
GPIO86: U1.87(GPIO86/EM1A13/EM1CAS/SCITXDB/MCLKXB/MCLKXA)
GPIO87: U1.88(GPIO87/EM1A14/EM1RAS/SCIRXDB/MFSXB/MFSXA)
GPIO89: U1.96(GPIO89/EM1A16/EM1DQM1/SCITXDC)
GPIO90: U1.97(GPIO90/EM1A17/EM1DQM2/SCIRXDC)
GPIO91: U1.98(GPIO91/EM1A18/EM1DQM3/SDAA)
GPIO92: U1.99(GPIO92/EM1A19/EM1BA1/SCLA)
GPIO99: U1.14(GPIO99/EM2A1/EQEP1I)
NetD9_A: D9.A R38.1
NetD9_C: D9.C U9.6(1Y)
NetD10_A: D10.A R39.1
NetD10_C: D10.C U9.4(2Y)

### Notes on the sheet
- F28377S_B
- 1.1
- 1
- 2
- 3
- 4
- 5
- 6
- A
- B
- C
- D
- E

### Library data of the parts
C24 C33-C36 = C-USC0402: <B>CAPACITOR</B>, American symbol
D9 D10 = LEDCHIP-LED0603: as D4 on sheet LAUNCHXL-F28377S_1
R36-R41 = R-US_R0402: <B>RESISTOR</B>, American symbol

## Sheet LAUNCHXL-F28377S_5.SchDoc: LAUNCHXL-F28377S.sch
size 301 x 237 mm; Date: 6/30/2015 1:28:00 PM; DocumentNumber: Document Number:; Revision: REV:; SheetNumber: 6
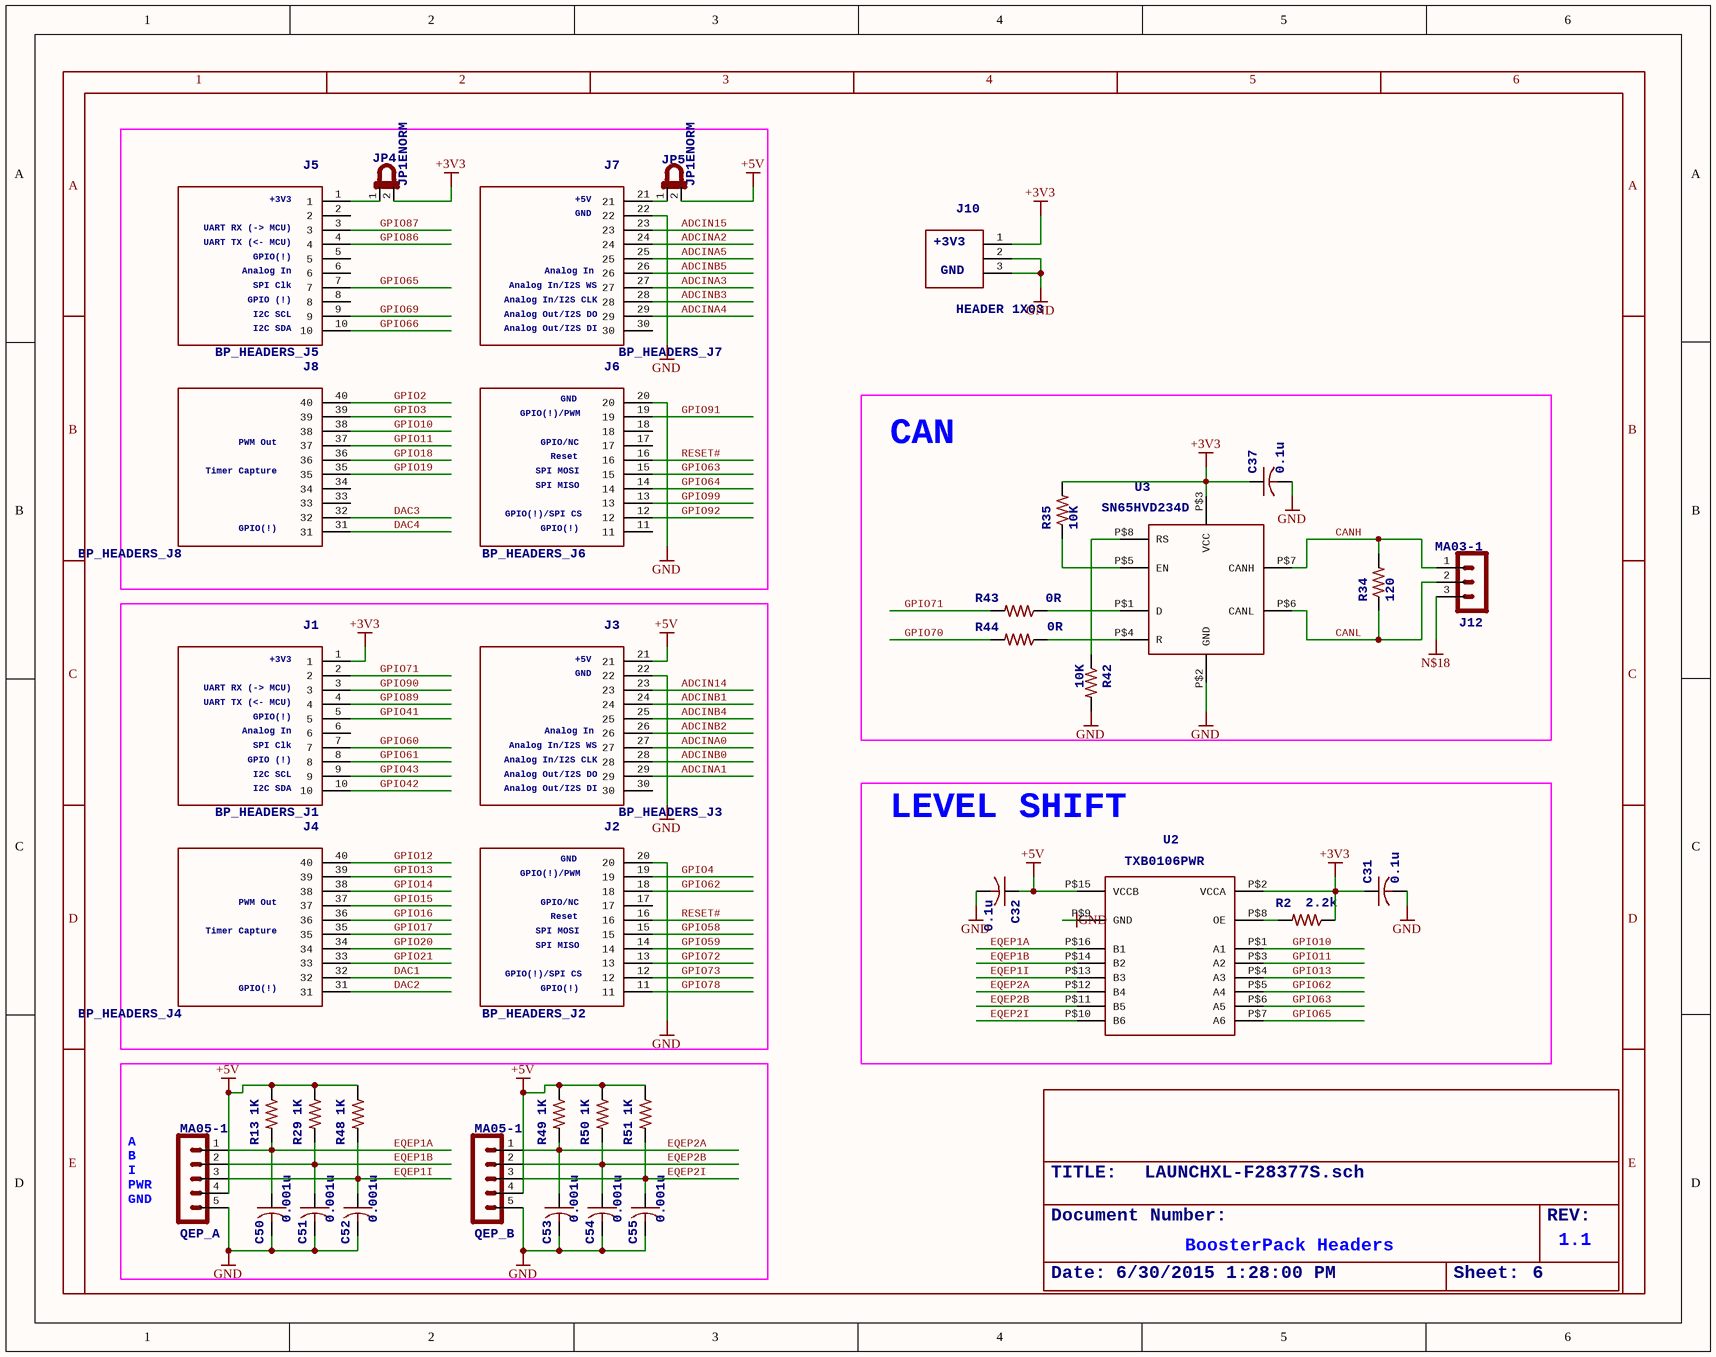
[diagram p5: LAUNCHXL-F28377S_5.SchDoc]

### Parts
C31  0.1u  [C0402]
C32  0.1u  [C0402]
C37  0.1u  [C0402]
C50  0.001u  [C0402]
C51  0.001u  [C0402]
C52  0.001u  [C0402]
C53  0.001u  [C0402]
C54  0.001u  [C0402]
C55  0.001u  [C0402]
J1  BP_HEADERS_J1  [J1]
J2  BP_HEADERS_J2  [J2]
J3  BP_HEADERS_J3  [J3]
J4  BP_HEADERS_J4  [J4]
J5  BP_HEADERS_J5  [J5]
J6  BP_HEADERS_J6  [J6]
J7  BP_HEADERS_J7  [J7]
J8  BP_HEADERS_J8  [J8]
J10  HEADER 1X03  [3PIN_PWR_3V3]
J12  MA03-1  [MA03-1]
JP4  JP1ENORM  [JP1]
JP5  JP1ENORM  [JP1]
QEP_A  MA05-1  [MA05-1]
QEP_B  MA05-1  [MA05-1]
R2  2.2k  [R0402]
R13  1K  [R0402]
R29  1K  [R0402]
R34  120  [R0402]
R35  10K  [R0402]
R42  10K  [R0402]
R43  0R  [R0402]
R44  0R  [R0402]
R48  1K  [R0402]
R49  1K  [R0402]
R50  1K  [R0402]
R51  1K  [R0402]
U2  TXB0106PWR  [TSSOP16-PW]
U3  SN65HVD234D  [SOIC8-PDSO]
U$12  ROY_JUMPER  [ROY_JUMPER]  (value not drawn)
U$13  ROY_JUMPER  [ROY_JUMPER]  (value not drawn)

### Blocks framed on the sheet
CAN: C37 J12 R34 R35 R42-R44 U3
LEVEL SHIFT: C31 C32 R2 U2

### Nets
+3V3: C31.1 C37.1 J1.1 J10.1 JP4.2 R2.1 R35.2 U2.P$2(VCCA) U3.P$3(VCC)
EQEP1A: C32.1 C50.1 C51.1 C52.1 C53.1 C54.1 C55.1 J3.21 JP5.2 QEP_A.1 QEP_A.2 QEP_A.3 QEP_A.4 QEP_B.1 QEP_B.2 QEP_B.3 QEP_B.4 R13.1 R13.2 R29.1 R29.2 R48.1 R48.2 R49.1 R49.2 R50.1 R50.2 R51.1 R51.2 U2.P$10(B6) U2.P$11(B5) U2.P$12(B4) U2.P$13(B3) U2.P$14(B2) U2.P$15(VCCB) U2.P$16(B1)  [also labelled +5V, EQEP1B, EQEP1I, EQEP2A, EQEP2B, EQEP2I]
GND: C31.2 C32.2 C37.2 C50.2 C51.2 C52.2 C53.2 C54.2 C55.2 J2.20 J3.22 J6.20 J7.22 J10.2 J10.3 QEP_A.5 QEP_B.5 R42.2 U2.P$9(GND) U3.P$2(GND)
N$18: J12.3
ADCIN14: J3.23
ADCIN15: J7.23
ADCINA0: J3.27
ADCINA1: J3.29
ADCINA2: J7.24
ADCINA3: J7.27
ADCINA4: J7.29
ADCINA5: J7.25
ADCINB0: J3.28
ADCINB1: J3.24
ADCINB2: J3.26
ADCINB3: J7.28
ADCINB4: J3.25
ADCINB5: J7.26
CANH: J12.1 R34.2 U3.P$7(CANH)
CANL: J12.2 R34.1 U3.P$6(CANL)
DAC1: J4.32
DAC2: J4.31
DAC3: J8.32
DAC4: J8.31
GPIO2: J8.40
GPIO3: J8.39
GPIO4: J2.19
GPIO10: J8.38 U2.P$1(A1)
GPIO11: J8.37 U2.P$3(A2)
GPIO12: J4.40
GPIO13: J4.39 U2.P$4(A3)
GPIO14: J4.38
GPIO15: J4.37
GPIO16: J4.36
GPIO17: J4.35
GPIO18: J8.36
GPIO19: J8.35
GPIO20: J4.34
GPIO21: J4.33
GPIO41: J1.5
GPIO42: J1.10
GPIO43: J1.9
GPIO58: J2.15
GPIO59: J2.14
GPIO60: J1.7
GPIO61: J1.8
GPIO62: J2.18 U2.P$5(A4)
GPIO63: J6.15 U2.P$6(A5)
GPIO64: J6.14
GPIO65: J5.7 U2.P$7(A6)
GPIO66: J5.10
GPIO69: J5.9
GPIO70: R44.2
GPIO71: J1.2 R43.2
GPIO72: J2.13
GPIO73: J2.12
GPIO78: J2.11
GPIO86: J5.4
GPIO87: J5.3
GPIO89: J1.4
GPIO90: J1.3
GPIO91: J6.19
GPIO92: J6.12
GPIO99: J6.13
RESET#: J2.16 J6.16
NetJ5_1: J5.1 JP4.1
NetJ7_21: J7.21 JP5.1
NetR2_2: R2.2 U2.P$8(OE)
NetR35_1: R35.1 U3.P$5(EN)
NetR42_1: R42.1 U3.P$8(RS)
NetR43_1: R43.1 U3.P$1(D)
NetR44_1: R44.1 U3.P$4(R)

Not connected (* = marked no-connect by the designer): J1 6; J2 17; J3 30; J5 2 5 6 8; J6 11 17 18; J7 30; J8 33 34

### Notes on the sheet
- A
- B
- I
- (near QEP_A) GND
- (near QEP_A) PWR
- BoosterPack Headers
- 1.1
- 1
- 2
- 3
- 4
- 5
- 6
- C
- D
- E

### Library data of the parts
C31 C32 C37 C50-C55 = C-USC0402: <B>CAPACITOR</B>, American symbol
J10 = BP_HEADERS_PWR_3V3-TH: CCO: 258-0001299; DESCRIPTION: CONN HEADER .100 SINGL STR 3POS; MAN: SULLINS; VALUE: HEADER 1X03; +3V3: +3V3; GND: GND
J12 = MA03-1: <b>PIN HEADER</b>; OC_FARNELL: unknown; OC_NEWARK: unknown
JP4 JP5 = JP1ENORM: <b>JUMPER</b>
QEP_A QEP_B = MA05-1: <b>PIN HEADER</b>; OC_FARNELL: unknown; OC_NEWARK: unknown
R2 R13 R29 R34 R35 R42-R44 R48-R51 = R-US_R0402: <B>RESISTOR</B>, American symbol
J1 = BP_HEADERS_J1: +3V3: +3V3; Analog In: Analog In; UART RX (-> MCU): UART RX (-> MCU); UART TX (<- MCU): UART TX (<- MCU); GPIO(!): GPIO(!); SPI Clk: SPI Clk; GPIO (!): GPIO (!); I2C SCL: I2C SCL; I2C SDA: I2C SDA
J2 = BP_HEADERS_J2: GND: GND; GPIO(!)/PWM: GPIO(!)/PWM; GPIO(!)/SPI CS: GPIO(!)/SPI CS; GPIO/NC: GPIO/NC; Reset: Reset; SPI MOSI: SPI MOSI; SPI MISO: SPI MISO; GPIO(!): GPIO(!)
J3 = BP_HEADERS_J3: +5V: +5V; GND: GND; Analog In: Analog In; Analog In/I2S WS: Analog In/I2S WS; Analog In/I2S CLK: Analog In/I2S CLK; Analog Out/I2S DO: Analog Out/I2S DO; Analog Out/I2S DI: Analog Out/I2S DI
J4 = BP_HEADERS_J4: PWM Out: PWM Out; Timer Capture: Timer Capture; GPIO(!): GPIO(!)
J5 = BP_HEADERS_J5: +3V3: +3V3; Analog In: Analog In; UART RX (-> MCU): UART RX (-> MCU); UART TX (<- MCU): UART TX (<- MCU); GPIO(!): GPIO(!); SPI Clk: SPI Clk; GPIO (!): GPIO (!); I2C SCL: I2C SCL; I2C SDA: I2C SDA
J6 = BP_HEADERS_J6: GND: GND; GPIO(!)/PWM: GPIO(!)/PWM; GPIO(!)/SPI CS: GPIO(!)/SPI CS; GPIO/NC: GPIO/NC; Reset: Reset; SPI MOSI: SPI MOSI; SPI MISO: SPI MISO; GPIO(!): GPIO(!)
J7 = BP_HEADERS_J7: +5V: +5V; GND: GND; Analog In: Analog In; Analog In/I2S WS: Analog In/I2S WS; Analog In/I2S CLK: Analog In/I2S CLK; Analog Out/I2S DO: Analog Out/I2S DO; Analog Out/I2S DI: Analog Out/I2S DI
J8 = BP_HEADERS_J8: PWM Out: PWM Out; Timer Capture: Timer Capture; GPIO(!): GPIO(!)

## Nets that join several sheets
+3V3: LAUNCHXL-F28377S_1 (8 pins), LAUNCHXL-F28377S_2 (20 pins), LAUNCHXL-F28377S_3 (7 pins), LAUNCHXL-F28377S_4 (C24.1 R38.2 R39.2 U9.5), LAUNCHXL-F28377S_5 (9 pins)
EQEP1A: LAUNCHXL-F28377S_2 (C25.1 C41.2 D3.C R17.1), LAUNCHXL-F28377S_5 (36 pins)
GND: LAUNCHXL-F28377S_1 (6 pins), LAUNCHXL-F28377S_2 (54 pins), LAUNCHXL-F28377S_3 (14 pins), LAUNCHXL-F28377S_4 (6 pins), LAUNCHXL-F28377S_5 (20 pins)
ADCIN14: LAUNCHXL-F28377S_3 (U1.26), LAUNCHXL-F28377S_5 (J3.23)
ADCIN15: LAUNCHXL-F28377S_3 (U1.27), LAUNCHXL-F28377S_5 (J7.23)
ADCINA0: LAUNCHXL-F28377S_3 (U1.25), LAUNCHXL-F28377S_5 (J3.27)
ADCINA1: LAUNCHXL-F28377S_3 (U1.24), LAUNCHXL-F28377S_5 (J3.29)
ADCINA2: LAUNCHXL-F28377S_3 (U1.23), LAUNCHXL-F28377S_5 (J7.24)
ADCINA3: LAUNCHXL-F28377S_3 (U1.22), LAUNCHXL-F28377S_5 (J7.27)
ADCINA4: LAUNCHXL-F28377S_3 (U1.21), LAUNCHXL-F28377S_5 (J7.29)
ADCINA5: LAUNCHXL-F28377S_3 (U1.20), LAUNCHXL-F28377S_5 (J7.25)
ADCINB0: LAUNCHXL-F28377S_3 (U1.28), LAUNCHXL-F28377S_5 (J3.28)
ADCINB1: LAUNCHXL-F28377S_3 (U1.29), LAUNCHXL-F28377S_5 (J3.24)
ADCINB2: LAUNCHXL-F28377S_3 (U1.30), LAUNCHXL-F28377S_5 (J3.26)
ADCINB3: LAUNCHXL-F28377S_3 (U1.31), LAUNCHXL-F28377S_5 (J7.28)
ADCINB4: LAUNCHXL-F28377S_3 (U1.32), LAUNCHXL-F28377S_5 (J3.25)
ADCINB5: LAUNCHXL-F28377S_3 (U1.33), LAUNCHXL-F28377S_5 (J7.26)
DAC1: LAUNCHXL-F28377S_4 (C36.1 R36.2), LAUNCHXL-F28377S_5 (J4.32)
DAC2: LAUNCHXL-F28377S_4 (C33.1 R37.2), LAUNCHXL-F28377S_5 (J4.31)
DAC3: LAUNCHXL-F28377S_4 (C34.1 R40.2), LAUNCHXL-F28377S_5 (J8.32)
DAC4: LAUNCHXL-F28377S_4 (C35.1 R41.2), LAUNCHXL-F28377S_5 (J8.31)
GPIO2: LAUNCHXL-F28377S_4 (U1.91), LAUNCHXL-F28377S_5 (J8.40)
GPIO3: LAUNCHXL-F28377S_4 (U1.92), LAUNCHXL-F28377S_5 (J8.39)
GPIO4: LAUNCHXL-F28377S_4 (U1.93), LAUNCHXL-F28377S_5 (J2.19)
GPIO10: LAUNCHXL-F28377S_4 (U1.100), LAUNCHXL-F28377S_5 (J8.38 U2.P$1)
GPIO11: LAUNCHXL-F28377S_4 (U1.1), LAUNCHXL-F28377S_5 (J8.37 U2.P$3)
GPIO12: LAUNCHXL-F28377S_4 (U1.3 U9.1), LAUNCHXL-F28377S_5 (J4.40)
GPIO13: LAUNCHXL-F28377S_4 (U1.4 U9.3), LAUNCHXL-F28377S_5 (J4.39 U2.P$4)
GPIO14: LAUNCHXL-F28377S_4 (U1.5), LAUNCHXL-F28377S_5 (J4.38)
GPIO15: LAUNCHXL-F28377S_4 (U1.6), LAUNCHXL-F28377S_5 (J4.37)
GPIO16: LAUNCHXL-F28377S_4 (U1.7), LAUNCHXL-F28377S_5 (J4.36)
GPIO17: LAUNCHXL-F28377S_4 (U1.8), LAUNCHXL-F28377S_5 (J4.35)
GPIO18: LAUNCHXL-F28377S_4 (R40.1 U1.9), LAUNCHXL-F28377S_5 (J8.36)
GPIO19: LAUNCHXL-F28377S_4 (R41.1 U1.11), LAUNCHXL-F28377S_5 (J8.35)
GPIO20: LAUNCHXL-F28377S_4 (R36.1 U1.12), LAUNCHXL-F28377S_5 (J4.34)
GPIO21: LAUNCHXL-F28377S_4 (R37.1 U1.13), LAUNCHXL-F28377S_5 (J4.33)
GPIO41: LAUNCHXL-F28377S_4 (U1.51), LAUNCHXL-F28377S_5 (J1.5)
GPIO42: LAUNCHXL-F28377S_4 (U1.73), LAUNCHXL-F28377S_5 (J1.10)
GPIO43: LAUNCHXL-F28377S_4 (U1.74), LAUNCHXL-F28377S_5 (J1.9)
GPIO58: LAUNCHXL-F28377S_4 (U1.52), LAUNCHXL-F28377S_5 (J2.15)
GPIO59: LAUNCHXL-F28377S_4 (U1.53), LAUNCHXL-F28377S_5 (J2.14)
GPIO60: LAUNCHXL-F28377S_4 (U1.54), LAUNCHXL-F28377S_5 (J1.7)
GPIO61: LAUNCHXL-F28377S_4 (U1.56), LAUNCHXL-F28377S_5 (J1.8)
GPIO62: LAUNCHXL-F28377S_4 (U1.57), LAUNCHXL-F28377S_5 (J2.18 U2.P$5)
GPIO63: LAUNCHXL-F28377S_4 (U1.58), LAUNCHXL-F28377S_5 (J6.15 U2.P$6)
GPIO64: LAUNCHXL-F28377S_4 (U1.59), LAUNCHXL-F28377S_5 (J6.14)
GPIO65: LAUNCHXL-F28377S_4 (U1.60), LAUNCHXL-F28377S_5 (J5.7 U2.P$7)
GPIO66: LAUNCHXL-F28377S_4 (U1.61), LAUNCHXL-F28377S_5 (J5.10)
GPIO69: LAUNCHXL-F28377S_4 (U1.75), LAUNCHXL-F28377S_5 (J5.9)
GPIO70: LAUNCHXL-F28377S_4 (U1.76), LAUNCHXL-F28377S_5 (R44.2)
GPIO71: LAUNCHXL-F28377S_4 (U1.77), LAUNCHXL-F28377S_5 (J1.2 R43.2)
GPIO72: LAUNCHXL-F28377S_3 (R9.2 S1.2), LAUNCHXL-F28377S_4 (U1.80), LAUNCHXL-F28377S_5 (J2.13)
GPIO73: LAUNCHXL-F28377S_4 (U1.81), LAUNCHXL-F28377S_5 (J2.12)
GPIO78: LAUNCHXL-F28377S_4 (U1.82), LAUNCHXL-F28377S_5 (J2.11)
GPIO84: LAUNCHXL-F28377S_1 (R30.2 U7.4), LAUNCHXL-F28377S_3 (R8.2 S1.1), LAUNCHXL-F28377S_4 (U1.85)
GPIO85: LAUNCHXL-F28377S_1 (R16.2 U5.11), LAUNCHXL-F28377S_4 (U1.86)
GPIO86: LAUNCHXL-F28377S_4 (U1.87), LAUNCHXL-F28377S_5 (J5.4)
GPIO87: LAUNCHXL-F28377S_4 (U1.88), LAUNCHXL-F28377S_5 (J5.3)
GPIO89: LAUNCHXL-F28377S_4 (U1.96), LAUNCHXL-F28377S_5 (J1.4)
GPIO90: LAUNCHXL-F28377S_4 (U1.97), LAUNCHXL-F28377S_5 (J1.3)
GPIO91: LAUNCHXL-F28377S_4 (U1.98), LAUNCHXL-F28377S_5 (J6.19)
GPIO92: LAUNCHXL-F28377S_4 (U1.99), LAUNCHXL-F28377S_5 (J6.12)
GPIO99: LAUNCHXL-F28377S_4 (U1.14), LAUNCHXL-F28377S_5 (J6.13)
JTAG_TRST: LAUNCHXL-F28377S_1 (R28.2 U7.5), LAUNCHXL-F28377S_3 (S1.4)
RESET#: LAUNCHXL-F28377S_3 (5 pins), LAUNCHXL-F28377S_5 (J2.16 J6.16)
TCK: LAUNCHXL-F28377S_1 (R20.2 U5.14), LAUNCHXL-F28377S_3 (U1.50)
TDI: LAUNCHXL-F28377S_1 (R19.2 U5.13), LAUNCHXL-F28377S_3 (U1.46)
TDO: LAUNCHXL-F28377S_1 (R32.2 U7.3), LAUNCHXL-F28377S_3 (U1.47)
TMS: LAUNCHXL-F28377S_1 (R18.2 U5.12), LAUNCHXL-F28377S_3 (U1.49)
VDD: LAUNCHXL-F28377S_2 (11 pins), LAUNCHXL-F28377S_3 (U1.16 39 45 63 71 78 84 89 95)
VDDA: LAUNCHXL-F28377S_2 (C27.1 C28.1 C30.1 L3.2), LAUNCHXL-F28377S_3 (U1.18 38)
VDDIO: LAUNCHXL-F28377S_2 (15 pins), LAUNCHXL-F28377S_3 (U1.2 10 15 40 44 55 62 72 79 83 90 94)
VDDOSC: LAUNCHXL-F28377S_2 (C71.1 C73.1 C74.1 L4.2), LAUNCHXL-F28377S_3 (U1.65 70)
VREFHIA: LAUNCHXL-F28377S_2 (R11.2 U11.1 U11.4), LAUNCHXL-F28377S_3 (U1.19)
VREFHIB: LAUNCHXL-F28377S_2 (R52.2 U13.1 U13.4), LAUNCHXL-F28377S_3 (U1.37)